# Altium schematic sheet ADE7758.SchDoc
size A4
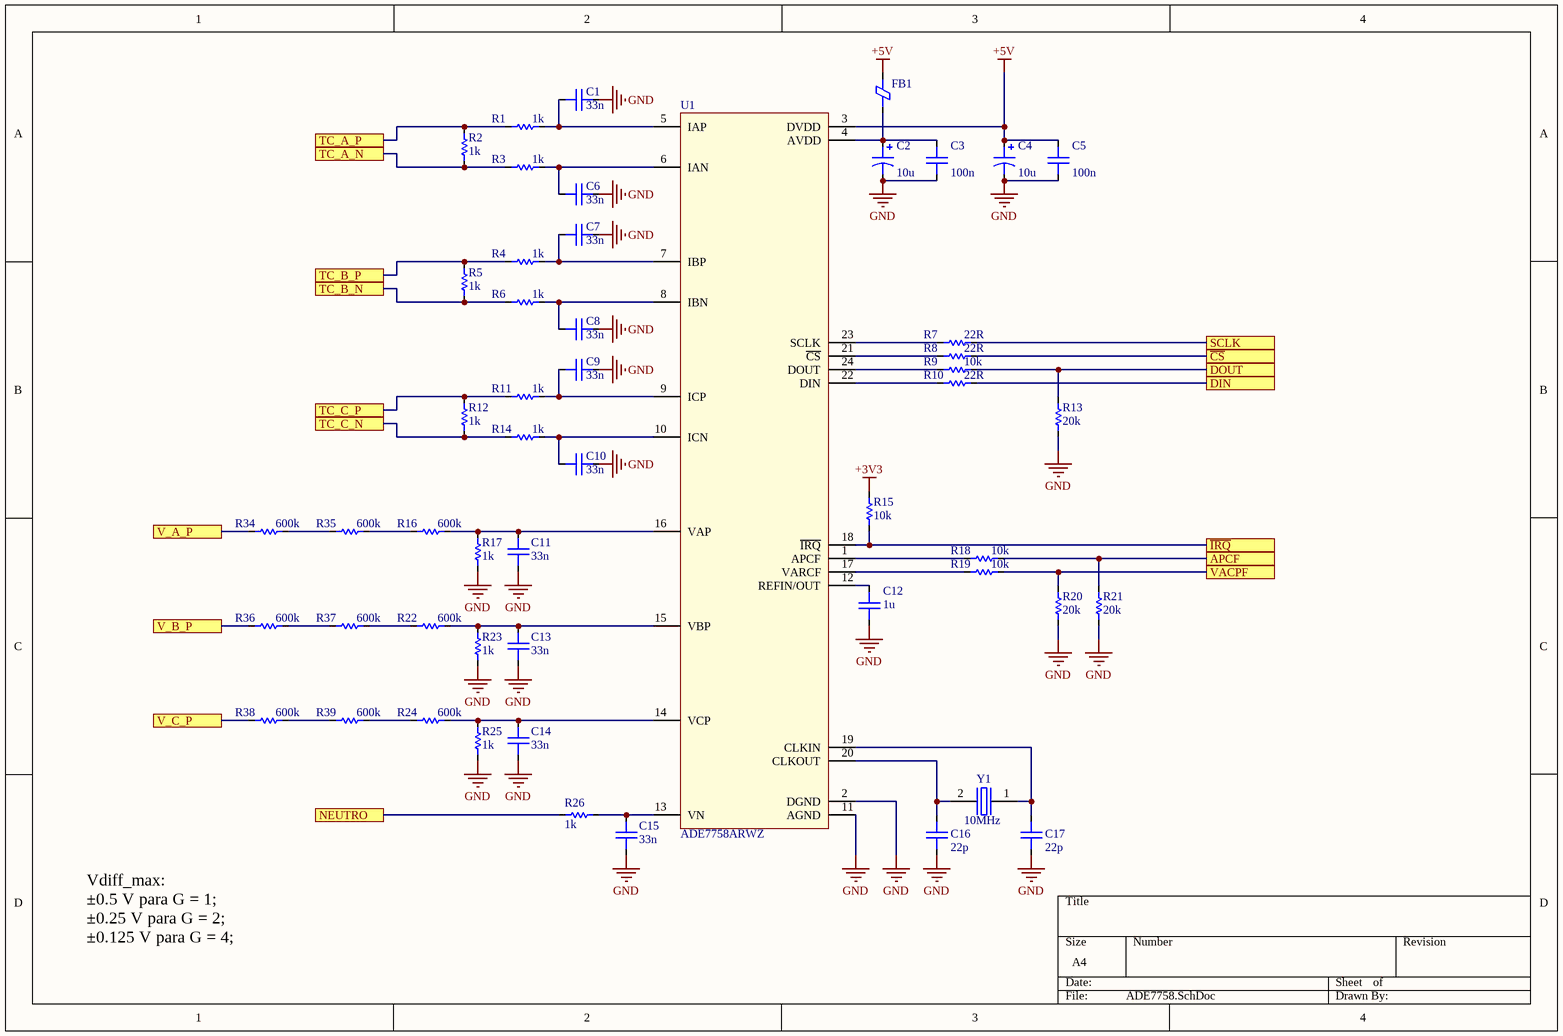
[diagram p0: ADE7758.SchDoc]

## Parts
C1  value 33n  [CAP0603]  (hidden comment: Capacitor)
C2  value 10u  [CAP1210 - TANTALUM]  (hidden comment: Capacitor)
C3  value 100n  [CAP0603]  (hidden comment: Capacitor)
C4  value 10u  [CAP1210 - TANTALUM]  (hidden comment: Capacitor)
C5  value 100n  [CAP0603]  (hidden comment: Capacitor)
C6  value 33n  [CAP0603]  (hidden comment: Capacitor)
C7  value 33n  [CAP0603]  (hidden comment: Capacitor)
C8  value 33n  [CAP0603]  (hidden comment: Capacitor)
C9  value 33n  [CAP0603]  (hidden comment: Capacitor)
C10  value 33n  [CAP0603]  (hidden comment: Capacitor)
C11  value 33n  [CAP0603]  (hidden comment: Capacitor)
C12  value 1u  [CAP0603]  (hidden comment: Capacitor)
C13  value 33n  [CAP0603]  (hidden comment: Capacitor)
C14  value 33n  [CAP0603]  (hidden comment: Capacitor)
C15  value 33n  [CAP0603]  (hidden comment: Capacitor)
C16  value 22p  [CAP0603]  (hidden comment: Capacitor)
C17  value 22p  [CAP0603]  (hidden comment: Capacitor)
FB1  Ferrite Bead  [FB0603]  (value not drawn)
R1  value 1k  [RES0603]  (hidden comment: Resistor)
R2  value 1k  [RES0603]  (hidden comment: Resistor)
R3  value 1k  [RES0603]  (hidden comment: Resistor)
R4  value 1k  [RES0603]  (hidden comment: Resistor)
R5  value 1k  [RES0603]  (hidden comment: Resistor)
R6  value 1k  [RES0603]  (hidden comment: Resistor)
R7  value 22R  [RES0603]  (hidden comment: Resistor)
R8  value 22R  [RES0603]  (hidden comment: Resistor)
R9  value 10k  [RES0603]  (hidden comment: Resistor)
R10  value 22R  [RES0603]  (hidden comment: Resistor)
R11  value 1k  [RES0603]  (hidden comment: Resistor)
R12  value 1k  [RES0603]  (hidden comment: Resistor)
R13  value 20k  [RES0603]  (hidden comment: Resistor)
R14  value 1k  [RES0603]  (hidden comment: Resistor)
R15  value 10k  [RES0603]  (hidden comment: Resistor)
R16  value 600k  [RES0603]  (hidden comment: Resistor)
R17  value 1k  [RES0603]  (hidden comment: Resistor)
R18  value 10k  [RES0603]  (hidden comment: Resistor)
R19  value 10k  [RES0603]  (hidden comment: Resistor)
R20  value 20k  [RES0603]  (hidden comment: Resistor)
R21  value 20k  [RES0603]  (hidden comment: Resistor)
R22  value 600k  [RES0603]  (hidden comment: Resistor)
R23  value 1k  [RES0603]  (hidden comment: Resistor)
R24  value 600k  [RES0603]  (hidden comment: Resistor)
R25  value 1k  [RES0603]  (hidden comment: Resistor)
R26  value 1k  [RES0603]  (hidden comment: Resistor)
R34  value 600k  [RES0603]  (hidden comment: Resistor)
R35  value 600k  [RES0603]  (hidden comment: Resistor)
R36  value 600k  [RES0603]  (hidden comment: Resistor)
R37  value 600k  [RES0603]  (hidden comment: Resistor)
R38  value 600k  [RES0603]  (hidden comment: Resistor)
R39  value 600k  [RES0603]  (hidden comment: Resistor)
U1  ADE7758ARWZ  [SOIC-24]
Y1  value 10MHz  [HDR1X2]  (hidden comment: Cristal)

## Ports
APCF, DIN, DOUT, NEUTRO, SCLK, TC_A_N, TC_A_P, TC_B_N, TC_B_P, TC_C_N, TC_C_P, V_A_P, V_B_P, V_C_P, VACPF, ~{CS}, ~{IRQ}

## Nets
+3V3: R15.1
+5V: C4.1 C5.2 FB1.1 U1.3(DVDD)
GND: C1.1 C2.2 C3.1 C4.2 C5.1 C6.1 C7.1 C8.1 C9.1 C10.1 C11.2 C12.1 C13.2 C14.2 C15.2 C16.1 C17.1 R13.2 R17.1 R20.2 R21.2 R23.1 R25.1 U1.2(DGND) U1.11(AGND)
APCF: R18.1 R21.1 ; port APCF
~{CS}: R8.1 ; port ~{CS}
DIN: R10.1 ; port DIN
DOUT: R9.1 R13.1 ; port DOUT
~{IRQ}: R15.2 U1.18(~{IRQ}) ; port ~{IRQ}
NEUTRO: R26.2 ; port NEUTRO
SCLK: R7.1 ; port SCLK
TC_A_N: R2.2 R3.2 ; port TC_A_N
TC_A_P: R1.2 R2.1 ; port TC_A_P
TC_B_N: R5.2 R6.2 ; port TC_B_N
TC_B_P: R4.2 R5.1 ; port TC_B_P
TC_C_N: R12.2 R14.2 ; port TC_C_N
TC_C_P: R11.2 R12.1 ; port TC_C_P
V_A_P: R34.2 ; port V_A_P
V_B_P: R36.2 ; port V_B_P
V_C_P: R38.2 ; port V_C_P
VACPF: R19.1 R20.1 ; port VACPF
NetC1_2: C1.2 R1.1 U1.5(IAP)
NetC2_1: C2.1 C3.2 FB1.2 U1.4(AVDD)
NetC6_2: C6.2 R3.1 U1.6(IAN)
NetC7_2: C7.2 R4.1 U1.7(IBP)
NetC8_2: C8.2 R6.1 U1.8(IBN)
NetC9_2: C9.2 R11.1 U1.9(ICP)
NetC10_2: C10.2 R14.1 U1.10(ICN)
NetC11_1: C11.1 R16.1 R17.2 U1.16(VAP)
NetC12_2: C12.2 U1.12(REFIN/OUT)
NetC13_1: C13.1 R22.1 R23.2 U1.15(VBP)
NetC14_1: C14.1 R24.1 R25.2 U1.14(VCP)
NetC15_1: C15.1 R26.1 U1.13(VN)
NetC16_2: C16.2 U1.20(CLKOUT) Y1.2
NetC17_2: C17.2 U1.19(CLKIN) Y1.1
NetR7_2: R7.2 U1.23(SCLK)
NetR8_2: R8.2 U1.21(~{CS})
NetR9_2: R9.2 U1.24(DOUT)
NetR10_2: R10.2 U1.22(DIN)
NetR16_2: R16.2 R35.1
NetR18_2: R18.2 U1.1(APCF)
NetR19_2: R19.2 U1.17(VARCF)
NetR22_2: R22.2 R37.1
NetR24_2: R24.2 R39.1
NetR34_1: R34.1 R35.2
NetR36_1: R36.1 R37.2
NetR38_1: R38.1 R39.2

## Notes on the sheet
- Vdiff_max:
  ±0.5 V para G = 1;
  ±0.25 V para G = 2;
  ±0.125 V para G = 4;

## Library data of the parts
C2 C4 = Capacitor Polarizado
U1 = ADE7758ARWZ: IC ENERGY METERING 3PHASE 24SOIC; Manufacturer: Analog Devices Inc.; PCB Info: -; Value: -; Part Number: ADE7758ARWZ
Y1 = Cristal: Manufacturer: ECS Inc.; PCB Info: -